# Altium project Esperto_Watch_V3.PrjPCB
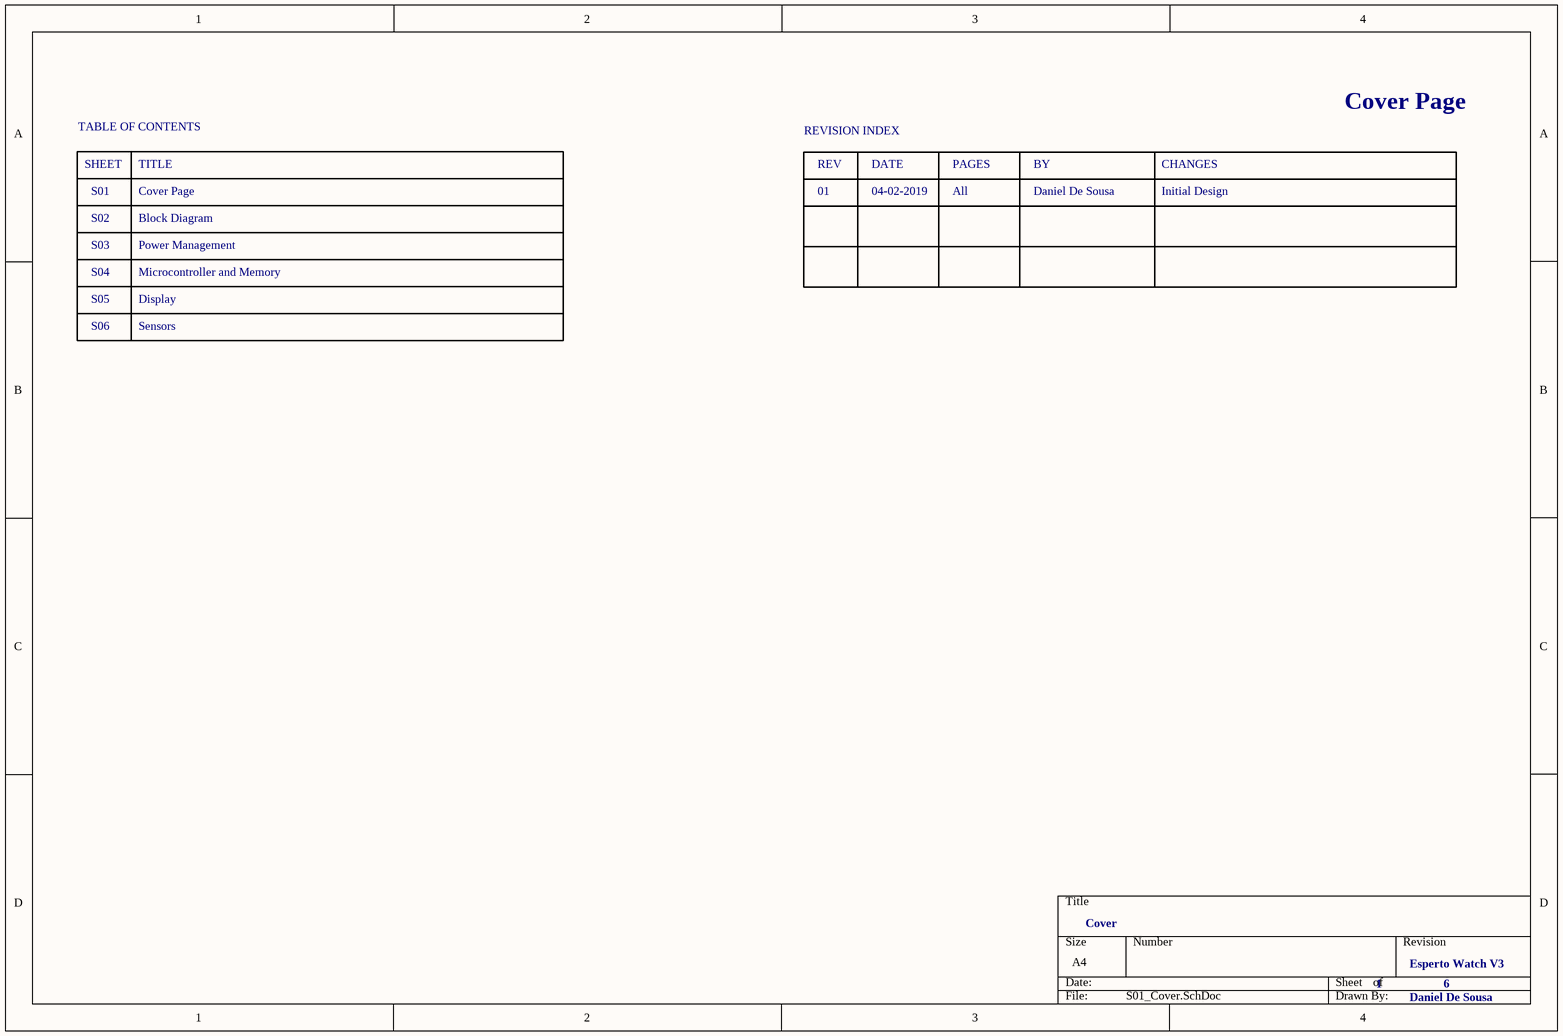
[diagram p0: S01_Cover.SchDoc]
client: Esperto Labs; PCBDate: 2019-01-02; PCBLayout: Daniel De Sousa; Project: Esperto Watch V3; ProjectTitle: Main Processor Board; SchRevision: 1
6 sheets, 69 parts. Net scope: flat (ports and power ports of the same name join across sheets).
Board file: Esperto_Watch_V3.PcbDoc
Sheets:
  S01_Cover.SchDoc
  S02_Block_Diagram.SchDoc
  S03_Power_Management.SchDoc
  S04_Microcontroller.SchDoc
  S05_Display.SchDoc
  S06_Sensors.SchDoc

## Sheet S01_Cover.SchDoc
size A4

### Notes on the sheet
- Cover Page
- TABLE OF CONTENTS
- SHEET
- TITLE
- REVISION INDEX
- REV
- DATE
- PAGES
- BY
- CHANGES
- S01
- S02
- S03
- Block Diagram
- Power Management
- 01
- 04-02-2019
- All
- Daniel De Sousa
- Initial Design
- S04
- S05
- Display
- Microcontroller and Memory
- S06
- Sensors
- Cover
- 1
- Esperto Watch V3
- 6

## Sheet S02_Block_Diagram.SchDoc
size A4
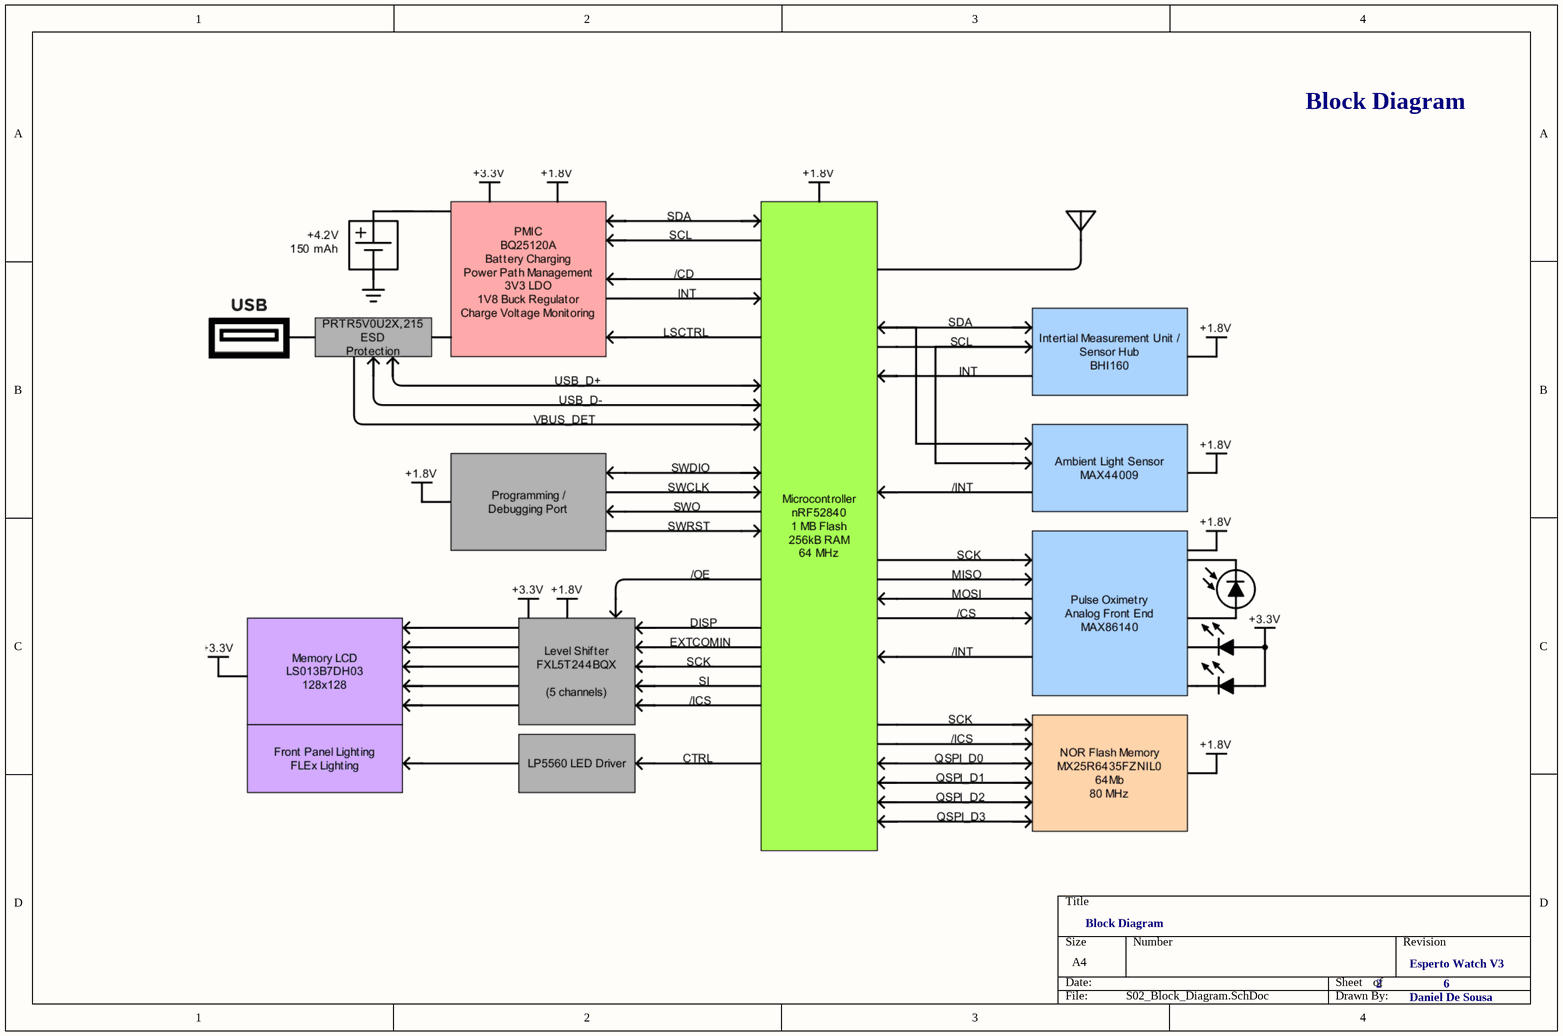
[diagram p1: S02_Block_Diagram.SchDoc]

### Notes on the sheet
- Block Diagram
- 2
- Esperto Watch V3
- 6
- Daniel De Sousa

## Sheet S03_Power_Management.SchDoc
size A4
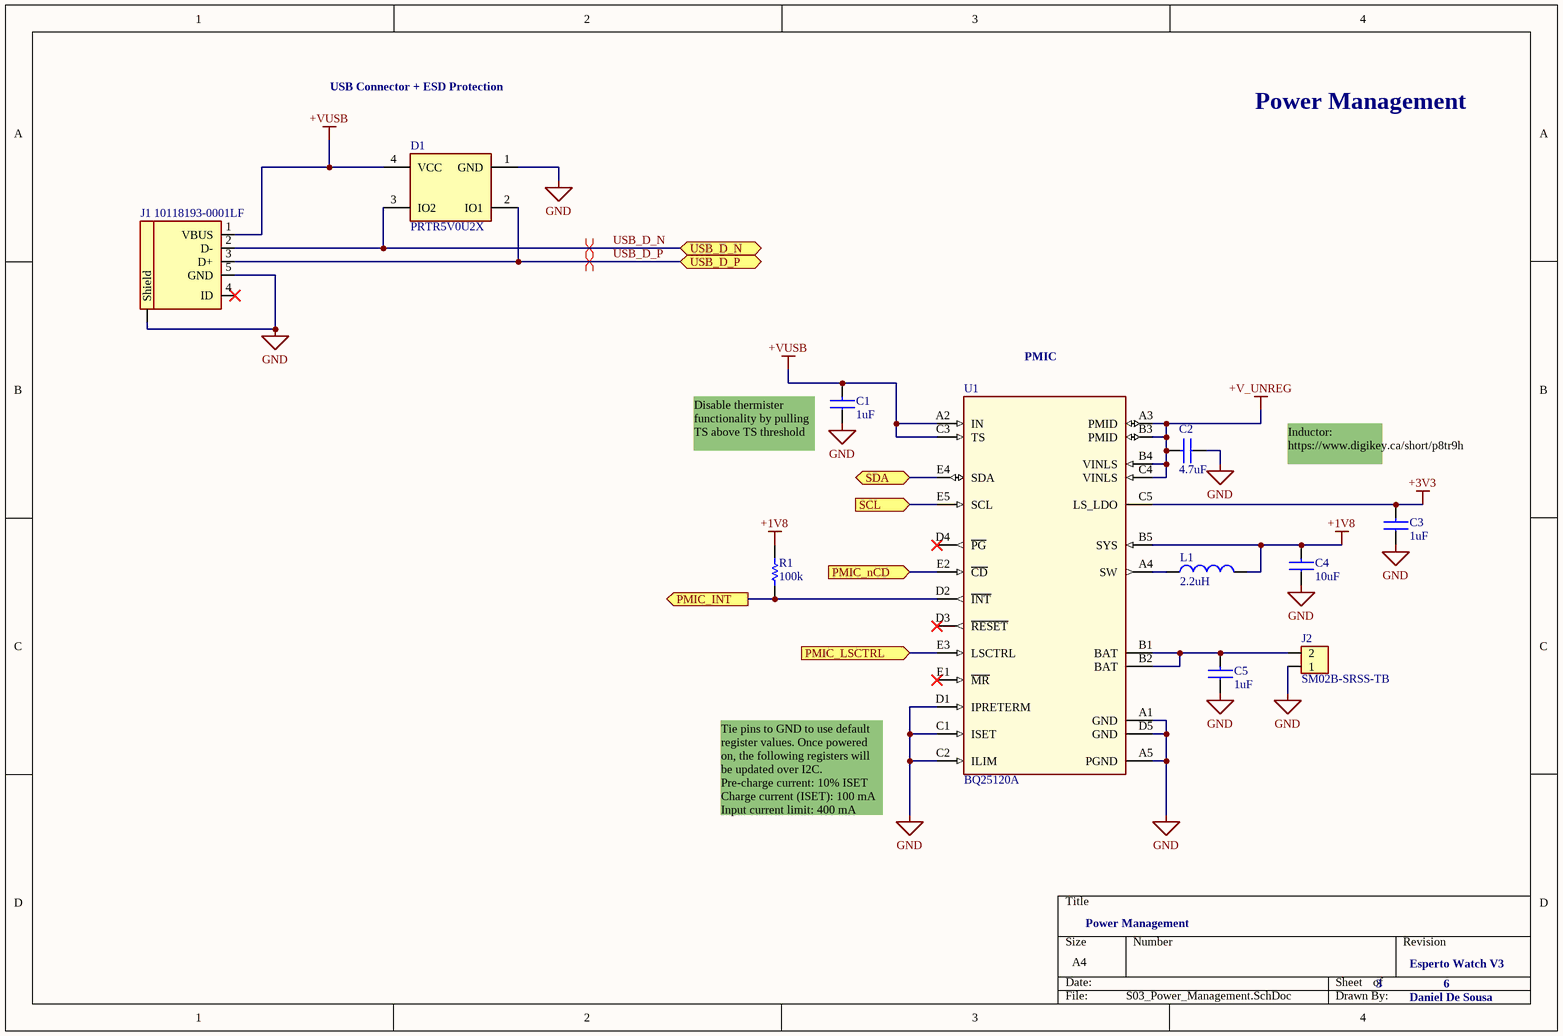
[diagram p2: S03_Power_Management.SchDoc]

### Parts
C1  1uF  [CC_1005_0402_N]
C2  4.7uF  [CC_1005_0402_N]
C3  1uF  [CC_1005_0402_N]
C4  10uF  [CC_1005_0402_N]
C5  1uF  [CC_1005_0402_N]
D1  PRTR5V0U2X  [PRTR5V0U2X]
J1  10118193-0001LF  [CONN_USB_MICRO_B]
J2  SM02B-SRSS-TB  [SM02B-SRSS-TB]
L1  2.2uH  [IND_1608_0603_N]
R1  100k  [RC_1005_0402_N]
U1  BQ25120A  [BQ25120A]

### Ports
PMIC_INT (out), PMIC_LSCTRL (in), PMIC_nCD (in), SCL (in), SDA (bidir), USB_D_N (bidir), USB_D_P (bidir)

### Nets
+1V8: C4.2 L1.2 R1.2 U1.B5(SYS)
+3V3: C3.2 U1.C5(LS_LDO)
+V_UNREG: C2.2 U1.A3(PMID) U1.B3(PMID) U1.B4(VINLS) U1.C4(VINLS)
+VUSB: C1.2 D1.4(VCC) J1.1(VBUS) U1.A2(IN) U1.C3(TS)
GND: C1.1 C2.1 C3.1 C4.1 C5.1 D1.1(GND) J1.5(GND) J1.6(Shield) J2.1 U1.A1(GND) U1.A5(PGND) U1.C1(ISET) U1.C2(ILIM) U1.D1(IPRETERM) U1.D5(GND)
PMIC_INT: R1.1 U1.D2(~{INT}) ; port PMIC_INT
PMIC_LSCTRL: U1.E3(LSCTRL) ; port PMIC_LSCTRL
PMIC_nCD: U1.E2(~{CD}) ; port PMIC_nCD
SCL: U1.E5(SCL) ; port SCL
SDA: U1.E4(SDA) ; port SDA
USB_D_N: D1.3(IO2) J1.2(D-) ; port USB_D_N
USB_D_P: D1.2(IO1) J1.3(D+) ; port USB_D_P
NetC5_2: C5.2 J2.2 U1.B1(BAT) U1.B2(BAT)
NetL1_1: L1.1 U1.A4(SW)

Not connected (* = marked no-connect by the designer): J1 4(ID)*; U1 D3(~{RESET})* D4(~{PG})* E1(~{MR})*

### Layout directives
differential pair: USB_D_N, USB_D_P

### Notes on the sheet
- USB Connector + ESD Protection
- Power Management
- PMIC
- (near C1) Disable thermister functionality by pulling TS above TS threshold
- Inductor: https://www.digikey.ca/short/p8tr9h
- Tie pins to GND to use default register values. Once powered on, the following registers will be updated over I2C.
  Pre-charge current: 10% ISET
  Charge current (ISET): 100 mA
  Input current limit: 400 mA
- 3
- Esperto Watch V3
- 6
- Daniel De Sousa

### Library data of the parts
C1-C5 = Capacitor
  C1 C3 C5: VALUE: 1uF
  C2: VALUE: 4.7uF
  C4: VALUE: 10uF
D1 = PRTR5V0U2X: Ultra low capacitance double rail-to-rail ESD protection diode; Manufacturer: NXP; 2nd source part number: 152-4157; Artikkelnr Noca: 10069015; Artikkelnr Simpro: N.A.; Part Number: PRTR5V0U2X; Manufacturer Part Number: PRTR5V0U2X; Datasheet: http://www.farnell.com/datasheets/109718.pdf; LatestRevisionDate: 2012-06-11; Publisher: Nordic Semiconductor; Published: 2012-06-11; Value: PRTR5V0U2X; Note: *; Supplier: Digi-Key; Supplier part number: 568-4140-1-ND; 2nd source Supplier: Farnell; Footprint Doc: SOT-143B
J1 = CONN_USB: MicroUSB-B-SMT; Part Number: USB-Micro-B-RA-SMD-PiP; Manufacturer: Allen Creations Corp.; Manufacturer Part Number: AJU55-BS2111-L; 2nd source part number: 609-4616-1-ND; Part number IPS: 00000007790; Artikkelnr Noca: 55029020; Artikkelnr Simpro: N.A.; Datasheet: \\hizz\pro\app9717\Datasheet\connectores\Allen Creations Corp\AJU-211.pdf; Footprint Doc: USB-Micro-B-RA-SMD-PiP; LatestRevisionDate: 2016-04-21; Pin Count: 5; Publisher: Nordic Semiconductor; Published: 2014-10-07; Value: MicroUSB-B; Note: *; Supplier: Cabcon; Supplier part number: AJU55-BS2111-L; 2nd source Supplier: Digi-Key
J2 = SM02B-SRSS-TB: 1.0mm pitch connector side entry SMD; Manufacturer: JST; Manufacturer Part Number: SM02B-SRSS-TB(LF)(SN); Part number IPS: 00000007791; Value: HDR-2, 1mm; Note: JST, Header; Artikkelnr Noca: 55010030; Artikkelnr Simpro: N.A.; Part Number: SM02B-SRSS-TB; Datasheet: http://www.jst-mfg.com/product/pdf/eng/eSH.pdf; Footprint Doc: SM02B-SRSS-TB; LatestRevisionDate: 2016-06-20; Pin Count: 2; Publisher: Nordic Semiconductor; Published: 2016-06-20; Supplier: Digi-Key; Supplier part number: 455-1802-1-ND; 2nd source Supplier: *; 2nd source part number: *
L1 = Inductor_0603: Inductor; VALUE: 2.2uH
R1 = Resistor: Value: 100k
U1 = BQ25120A: Battery Charge Management Solution; Manufacturer_Part_Number: BQ25120YFPR; Alternate_PartNumber: BQ25120YFPT; Vendor: Texas Instruments; Built_By: Texas_Instrument_Team; CompType: IC; Copyright: Copyright (C) 2018 Accelerated Designs. All rights reserved; RefDes: RefDes; Type: DEV; Value: Value; Application_BuildNumber: *; PartNumber: BQ25120YFPR; PackageReference: YFP0025BABD; MountType: SMT; RoHS: Y; Manufacturer: Texas Instruments

## Sheet S04_Microcontroller.SchDoc
size A4
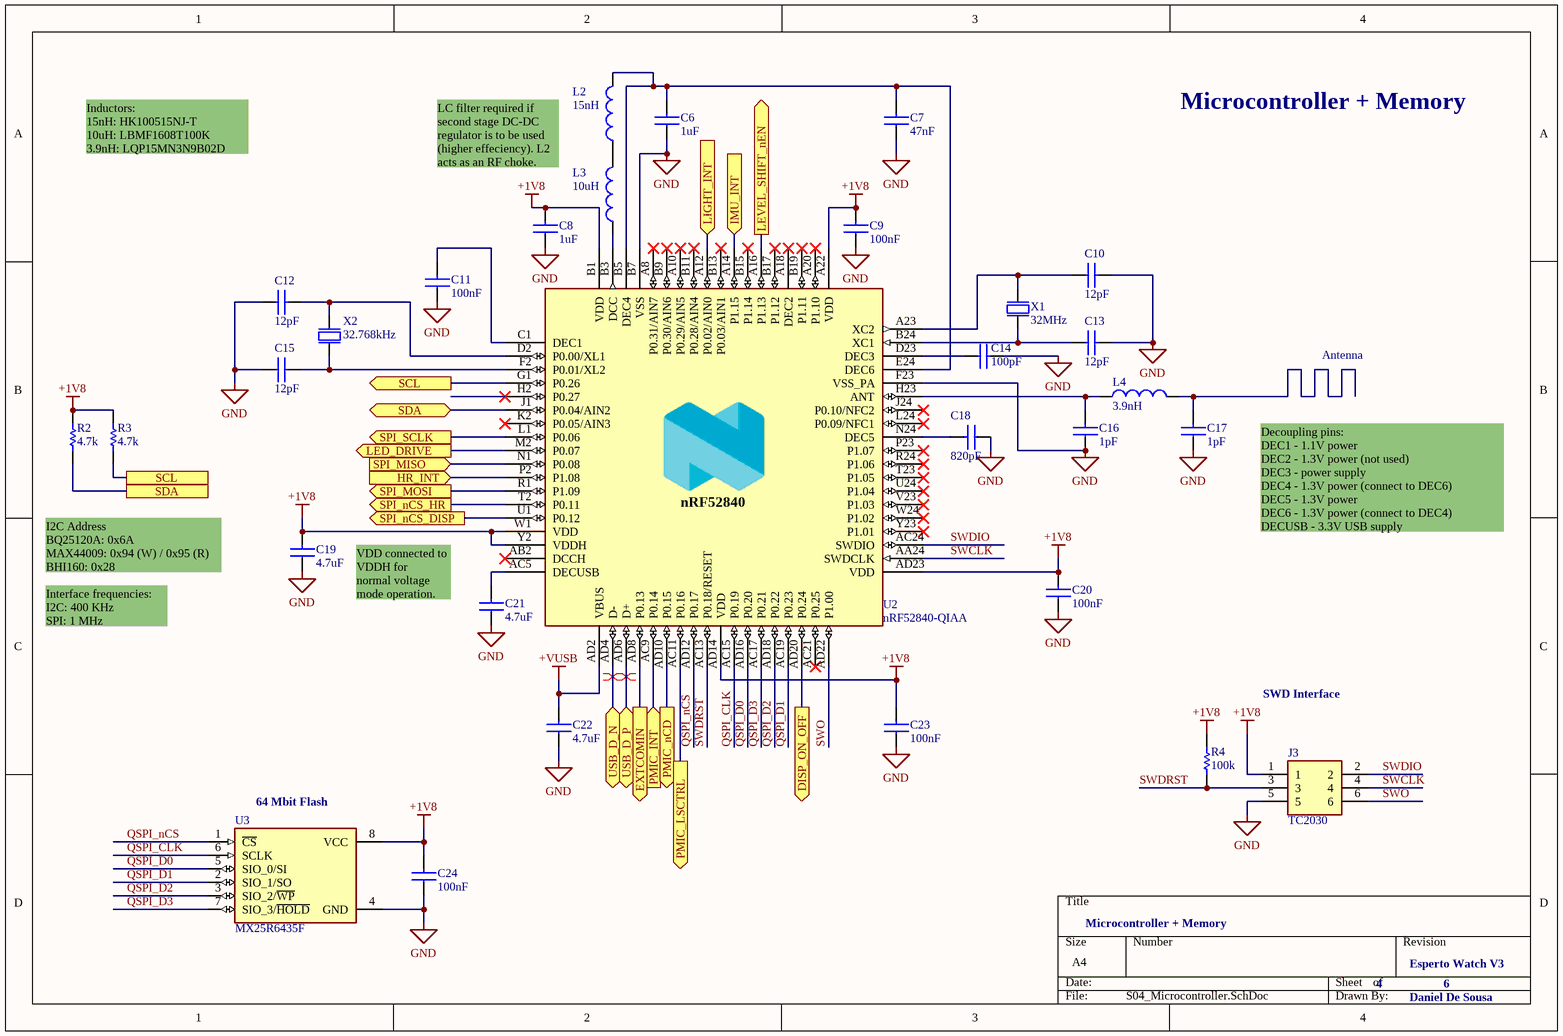
[diagram p3: S04_Microcontroller.SchDoc]

### Parts
C6  1uF  [CC_1005_0402_N]
C7  47nF  [CC_1005_0402_N]
C8  1uF  [CC_1005_0402_N]
C9  100nF  [CC_1005_0402_N]
C10  12pF  [CC_1005_0402_N]
C11  100nF  [CC_1005_0402_N]
C12  12pF  [CC_1005_0402_N]
C13  12pF  [CC_1005_0402_N]
C14  100pF  [CC_1005_0402_N]
C15  12pF  [CC_1005_0402_N]
C16  1pF  [CC_1005_0402_N]
C17  1pF  [CC_1005_0402_N]
C18  820pF  [CC_1005_0402_N]
C19  4.7uF  [CC_1005_0402_N]
C20  100nF  [CC_1005_0402_N]
C21  4.7uF  [CC_1005_0402_N]
C22  4.7uF  [CC_1005_0402_N]
C23  100nF  [CC_1005_0402_N]
C24  100nF  [CC_1005_0402_N]
J3  TC2030  [CONN_TC2030]  (no BOM)
L2  15nH  [RC_1005_0402_N]
L3  10uH  [IND_1608_0603_N]
L4  3.9nH  [RC_1005_0402_N]
R2  4.7k  [RC_1005_0402_N]
R3  4.7k  [RC_1005_0402_N]
R4  100k  [RC_1005_0402_N]
U2  nRF52840-QIAA  [nRF52840]
U3  MX25R6435F  [MX25R6435FZNIL0]
X1  32MHz  [XTAL_32M]
X2  32.768kHz  [XTAL_32K768]

### Ports
DISP_ON_OFF (out), EXTCOMIN (out), HR_INT (in), IMU_INT (in), LED_DRIVE (out), LEVEL_SHIFT_nEN (out), LIGHT_INT (in), PMIC_INT (in), PMIC_LSCTRL (out), PMIC_nCD (out), SCL, SCL (out), SDA, SDA (bidir), SPI_MISO (in), SPI_MOSI (out), SPI_nCS_DISP (out), SPI_nCS_HR (out), SPI_SCLK (out), USB_D_N (bidir), USB_D_P (bidir)

### Nets
+1V8: C8.2 C9.2 C19.2 C20.2 C23.2 C24.2 J3.1 R2.2 R3.2 R4.2 U2.A22(VDD) U2.AD14(VDD) U2.AD23(VDD) U2.B1(VDD) U2.W1(VDD) U2.Y2(VDDH) U3.8(VCC)
+VUSB: C22.2 U2.AD2(VBUS)
GND: C6.1 C7.1 C8.1 C9.1 C10.2 C11.1 C12.1 C13.2 C14.2 C15.1 C16.1 C17.1 C18.1 C19.1 C20.1 C21.1 C22.1 C23.1 C24.1 J3.5 U2.74(GND) U2.B7(VSS) U2.F23(VSS_PA) U3.4(GND) U3.9(GND) X1.2(GND) X1.4(GND)
DISP_ON_OFF: U2.AD20(P0.24) ; port DISP_ON_OFF
EXTCOMIN: U2.AD8(P0.13) ; port EXTCOMIN
HR_INT: U2.P2(P1.08) ; port HR_INT
IMU_INT: U2.A14(P1.15) ; port IMU_INT
LED_DRIVE: U2.M2(P0.07) ; port LED_DRIVE
LEVEL_SHIFT_nEN: U2.A16(P1.13) ; port LEVEL_SHIFT_nEN
LIGHT_INT: U2.A12(P0.02/AIN0) ; port LIGHT_INT
PMIC_INT: U2.AC9(P0.14) ; port PMIC_INT
PMIC_LSCTRL: U2.AC11(P0.16) ; port PMIC_LSCTRL
PMIC_nCD: U2.AD10(P0.15) ; port PMIC_nCD
QSPI_CLK: U2.AC15(P0.19) U3.6(SCLK)
QSPI_D0: U2.AD16(P0.20) U3.5(SIO_0/SI)
QSPI_D1: U2.AC19(P0.23) U3.2(SIO_1/SO)
QSPI_D2: U2.AD18(P0.22) U3.3(SIO_2/~{WP})
QSPI_D3: U2.AC17(P0.21) U3.7(SIO_3/~{HOLD})
QSPI_nCS: U2.AD12(P0.17) U3.1(~{CS})
SCL: R3.1 U2.G1(P0.26) ; port SCL
SDA: R2.1 U2.J1(P0.04/AIN2) ; port SDA
SPI_MISO: U2.N1(P0.08) ; port SPI_MISO
SPI_MOSI: U2.R1(P1.09) ; port SPI_MOSI
SPI_nCS_DISP: U2.U1(P0.12) ; port SPI_nCS_DISP
SPI_nCS_HR: U2.T2(P0.11) ; port SPI_nCS_HR
SPI_SCLK: U2.L1(P0.06) ; port SPI_SCLK
SWCLK: J3.4 U2.AA24(SWDCLK)
SWDIO: J3.2 U2.AC24(SWDIO)
SWDRST: J3.3 R4.1 U2.AC13(P0.18/RESET)
SWO: J3.6 U2.AD22(P1.00)
USB_D_N: U2.AD4(D-) ; port USB_D_N
USB_D_P: U2.AD6(D+) ; port USB_D_P
NetC6_2: C6.2 C7.2 L2.2 U2.B5(DEC4) U2.E24(DEC6)
NetC10_1: C10.1 U2.A23(XC2) X1.3(out)
NetC11_2: C11.2 U2.C1(DEC1)
NetC12_2: C12.2 U2.D2(P0.00/XL1) X2.2(out)
NetC13_1: C13.1 U2.B24(XC1) X1.1(inp)
NetC14_1: C14.1 U2.D23(DEC3)
NetC15_2: C15.2 U2.F2(P0.01/XL2) X2.1(inp)
NetC16_2: C16.2 L4.1 U2.H23(ANT)
NetC17_2: C17.2 L4.2
NetC18_2: C18.2 U2.N24(DEC5)
NetC21_2: C21.2 U2.AC5(DECUSB)
NetL2_1: L2.1 L3.2
NetL3_1: L3.1 U2.B3(DCC)

Not connected (* = marked no-connect by the designer): U2 A8(P0.31/AIN7)* A10(P0.29/AIN5)* A18(DEC2)* A20(P1.10)* AB2(DCCH)* AC21(P0.25)* B9(P0.30/AIN6)* B11(P0.28/AIN4)* B13(P0.03/AIN1)* B15(P1.14)* B17(P1.12)* B19(P1.11)* H2(P0.27)* J24(P0.10/NFC2)* K2(P0.05/AIN3)* L24(P0.09/NFC1)* P23(P1.07)* R24(P1.06)* T23(P1.05)* U24(P1.04)* V23(P1.03)* W24(P1.02)* Y23(P1.01)*

### Layout directives
differential pair: USB_D_N, USB_D_P

### Notes on the sheet
- Microcontroller + Memory
- Inductors:
  15nH: HK100515NJ-T
  10uH: LBMF1608T100K
  3.9nH: LQP15MN3N9B02D
- LC filter required if second stage DC-DC regulator is to be used (higher effeciency). L2 acts as an RF choke.
- Antenna
- I2C Address
  BQ25120A: 0x6A
  MAX44009: 0x94 (W) / 0x95 (R)
  BHI160: 0x28
- Decoupling pins:
  DEC1 - 1.1V power
  DEC2 - 1.3V power (not used)
  DEC3 - power supply
  DEC4 - 1.3V power (connect to DEC6)
  DEC5 - 1.3V power
  DEC6 - 1.3V power (connect to DEC4)
  DECUSB - 3.3V USB supply
- Interface frequencies:
  I2C: 400 KHz
  SPI: 1 MHz
- VDD connected to VDDH for
  normal voltage mode operation.
  Disables first regulator stage
- SWD Interface
- (near U3) 64 Mbit Flash
- 4
- Esperto Watch V3
- 6
- Daniel De Sousa

### Library data of the parts
C6-C24 = Capacitor
  C6 C8: VALUE: 1uF
  C7: VALUE: 47nF
  C9 C11 C20 C23 C24: VALUE: 100nF
  C10 C12 C13 C15: VALUE: 12pF
  C14: VALUE: 100pF
  C16 C17: VALUE: 1pF
  C18: VALUE: 820pF
  C19 C21 C22: VALUE: 4.7uF
L2 L4 = Inductor_0402: Inductor
  L2: VALUE: 15nH
  L4: VALUE: 3.9nH
L3 = Inductor_0603: Inductor; VALUE: 10uH
R2-R4 = Resistor
  R2 R3: Value: 4.7k
  R4: Value: 100k
U2 = nRF52840: Multi-protocol Bluetooth Low Energy, IEEE 802.15.4, ANT and 2.4GHz proprietary system-on-chip; Part Number: nRF52840-QIAAC0; Manufacturer: Nordic Semiconductor; Artikkelnr Noca: N.A.; LatestRevisionDate: 2017-12-06; Pin Count: 73; Publisher: Nordic Semiconductor; Published: 2017-08-21; Value: nRF52840-QIAA; Note: *; Footprint Doc: AQFN-73; Manufacturer Part Number: nRF52840-QIAAC0; Supplier: Nordic Semiconductor; Supplier part number: nRF52840-QIAAC0; 2nd source Supplier: *; 2nd source part number: *; Artikkelnr Simpro: N.A.; Part number IPS: N.A.; ComponentLink1Description: Datasheet; ComponentLink1URL: *; ComponentLink2Description: Supplier link; ComponentLink2URL: *; HelpURL: *
U3 = MX25R6435FZNIL0: Ultra low power, 64M-bit, serial multi I/O flash memory; Manufacturer: Macronix; Artikkelnr Noca: 15020015; Artikkelnr Simpro: N.A.; Part Number: MX25R6435FZNIL0; Manufacturer Part Number: MX25R6435FZNIL0; Datasheet: http://www.macronix.com/Lists/Datasheet/Attachments/3881/MX25R6435F,%20Wide%20Range,%2064Mb,%20v1.3.pdf; Footprint Doc: WSON-8; LatestRevisionDate: 2016-06-29; Pin Count: 8; Publisher: Nordic Semiconductor; Published: 2016-06-29; Value: MX25R6435F; Note: *; Supplier: Future; Supplier part number: MX25R6435FZNIL0; 2nd source Supplier: Arrow; 2nd source part number: MX25R6435FZNIL0
X1 = XTAL_32M: XTAL SMD 2016, 32MHz, Cl=8pF, Tol: ±10ppm, Stab: ±10ppm; Part Number: XTAL_SMD2016_32MHz_8pF_Murata; Manufacturer: Murata; Manufacturer Part Number: XRCGB32M000F1H01R0; Part number IPS: 80000001424; Note: XTAL SMD 32.000MHz; Artikkelnr Noca: N.A.; LatestRevisionDate: 2017-11-09; Pin Count: 4; Publisher: Nordic Semiconductor; Published: 2016-10-26; Value: 32MHz; Supplier: *; Supplier part number: *; 2nd source Supplier: *; 2nd source part number: *; Footprint Doc: XTAL_2016; Artikkelnr Simpro: N.A.; ComponentLink1Description: Datasheet; ComponentLink1URL: *; ComponentLink2Description: Supplier link; ComponentLink2URL: *; HelpURL: http://www.murata.com/en-global/products/productdetail.aspx?cate=cgsubCrystalUnits&partno=XRCGB32M000F1H01R0
X2 = XTAL_32K768: XTAL SMD 2012, 32.768kHz, 9pF, ±20ppm; Part Number: XTAL_SMD2012_32.768kHz_9pF_Seiko; Manufacturer: Seiko; Manufacturer Part Number: SC20S-9.0PF20PPM; Part number IPS: 80000001425; Note: XTAL SMD 32.768kHz; Artikkelnr Noca: N.A.; LatestRevisionDate: 2017-11-09; Pin Count: 2; Publisher: Nordic Semiconductor; Published: 2015-10-15; Value: 32.768kHz; Supplier: *; Supplier part number: *; 2nd source Supplier: *; 2nd source part number: *; Footprint Doc: XTAL_2012; Artikkelnr Simpro: N.A.; ComponentLink1Description: Datasheet; ComponentLink1URL: *; ComponentLink2Description: Supplier link; ComponentLink2URL: *; HelpURL: http://www.sii.co.jp/en/quartz/files/2013/03/file_PRODUCT_MASTER_50811_GRAPHIC03.pdf

## Sheet S05_Display.SchDoc
size A4
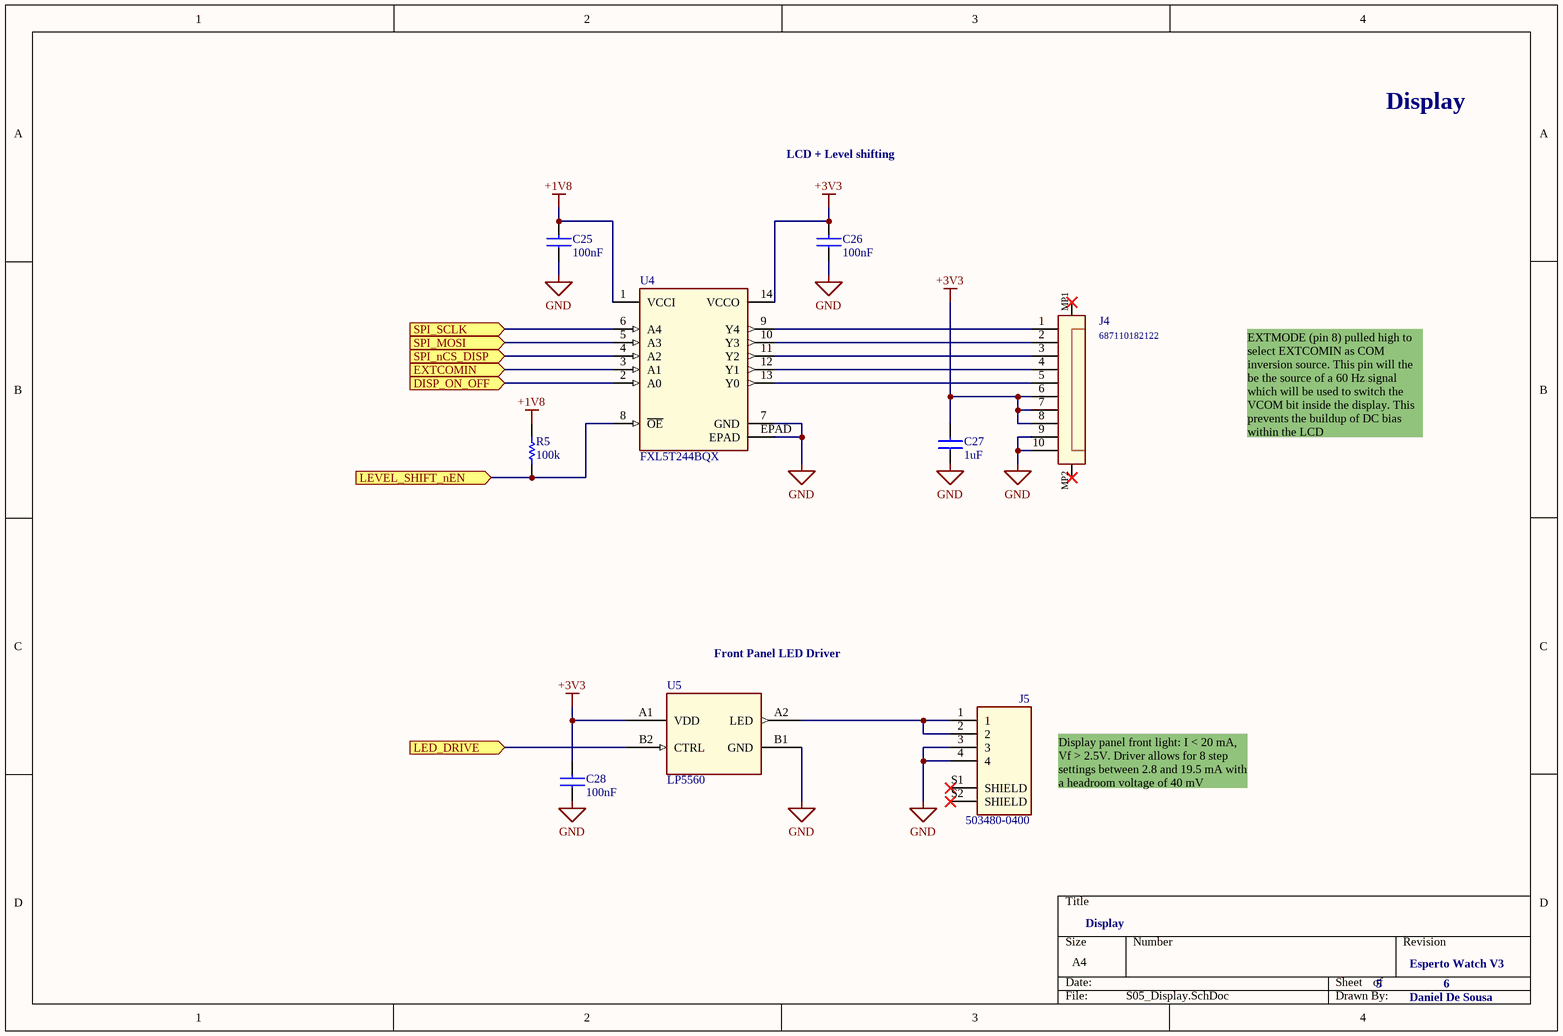
[diagram p4: S05_Display.SchDoc]

### Parts
C25  100nF  [CC_1005_0402_N]
C26  100nF  [CC_1005_0402_N]
C27  1uF  [CC_1005_0402_N]
C28  100nF  [CC_1005_0402_N]
J4  687110182122  [687110182122]
J5  503480-0400  [503480-0400]
R5  100k  [RC_1005_0402_N]
U4  FXL5T244BQX  [FXL5T244BQX]
U5  LP5560  [LP5560]

### Ports
DISP_ON_OFF (in), EXTCOMIN (in), LED_DRIVE (in), LEVEL_SHIFT_nEN (in), SPI_MOSI (in), SPI_nCS_DISP (in), SPI_SCLK (in)

### Nets
+1V8: C25.2 R5.2 U4.1(VCCI)
+3V3: C26.2 C27.2 C28.2 J4.6 J4.7 J4.8 U4.14(VCCO) U5.A1(VDD)
GND: C25.1 C26.1 C27.1 C28.1 J4.9 J4.10 J5.3 J5.4 U4.7(GND) U4.EPAD U5.B1(GND)
DISP_ON_OFF: U4.2(A0) ; port DISP_ON_OFF
EXTCOMIN: U4.3(A1) ; port EXTCOMIN
LED_DRIVE: U5.B2(CTRL) ; port LED_DRIVE
LEVEL_SHIFT_nEN: R5.1 U4.8(~{OE}) ; port LEVEL_SHIFT_nEN
SPI_MOSI: U4.5(A3) ; port SPI_MOSI
SPI_nCS_DISP: U4.4(A2) ; port SPI_nCS_DISP
SPI_SCLK: U4.6(A4) ; port SPI_SCLK
NetJ4_1: J4.1 U4.9(Y4)
NetJ4_2: J4.2 U4.10(Y3)
NetJ4_3: J4.3 U4.11(Y2)
NetJ4_4: J4.4 U4.12(Y1)
NetJ4_5: J4.5 U4.13(Y0)
NetJ5_1: J5.1 J5.2 U5.A2(LED)

Not connected (* = marked no-connect by the designer): J4 MP1* MP2*; J5 S1(SHIELD)* S2(SHIELD)*

### Notes on the sheet
- Display
- LCD + Level shifting
- EXTMODE (pin 8) pulled high to select EXTCOMIN as COM inversion source. This pin will the be the source of a 60 Hz signal which will be used to switch the VCOM bit inside the display. This prevents the buildup of DC bias within the LCD
- Front Panel LED Driver
- Display panel front light: I < 20 mA, Vf > 2.5V. Driver allows for 8 step settings between 2.8 and 19.5 mA with a headroom voltage of 40 mV
- 5
- Esperto Watch V3
- 6
- Daniel De Sousa

### Library data of the parts
C25-C28 = Capacitor
  C25 C26 C28: VALUE: 100nF
  C27: VALUE: 1uF
J4 = 687110182122: SMT ZIF Connectors WR-FPC, Horizontal, Back Locking Dual Contact, pitch 0.5 mm, 10 pins; Rated Current: 0.5 A; Contact Resistance: 30 mOhm; Withstanding Voltage: 250 VAC; Working Voltage: 50 VAC; Pin Number: 10; Pitch: 0.5 mm; ComponentLink1Description: Manufacturer; ComponentLink1URL: http://www.we-online.de; ComponentLink2Description: Datasheet; ComponentLink2URL: https://katalog.we-online.de/em/datasheet/687110182122.pdf; Part Number: 687110182122; Published Date: August 2018; Publisher: Wurth Elektronik; Operating Temperature: -55 to 85 degC; Packaging: Tape and Reel; Mounting Technology: SMT; Orientation: Horizontal; Contact Design: Back Locking Dual Contact
J5 = 503480-0400: 0.50mm Pitch Easy-On; MP: 5034800400; MF: Molex; Package: None; SnapEDA_Link: https://www.snapeda.com/parts/5034800400/Molex/view-part/?ref=snap; Digi-Key_Part_Number: WM1386CT-ND; Digi-Key_Purchase_URL: https://www.digikey.ca/product-detail/en/molex/5034800400/WM1386CT-ND/2356640?utm_source=snapeda&utm_medium=aggregator&utm_campaign=symbol; Value: *
R5 = Resistor: Value: 100k
U4 = FXL5T244BQX: Voltage Level Translator Unidirectional 1 Circuit 5 Channel; MF: ON Semiconductor; MP: FXLA108BQX; Package: DQFN-20 ON Semiconductor; Digi-Key_Purchase_URL: https://www.digikey.ca/product-detail/en/on-semiconductor/FXLA108BQX/FXLA108BQXCT-ND/2051660?utm_source=snapeda&utm_medium=aggregator&utm_campaign=symbol; Digi-Key_Part_Number: FXLA108BQXCT-ND; SnapEDA_Link: https://www.snapeda.com/parts/FXLA108BQX/ON%20Semiconductor/view-part/?ref=snap; Value: *
U5 = LP5560: Programmable Single-LED Driver; Manufacturer_Part_Number: LP5522TM/NOPB; Vendor: Texas Instruments; Built_By: EMA_UL_Team; Copyright: Copyright (C) 2018 Accelerated Designs. All rights reserved; RefDes: RefDes; Type: DEV; Value: Value

## Sheet S06_Sensors.SchDoc
size A4
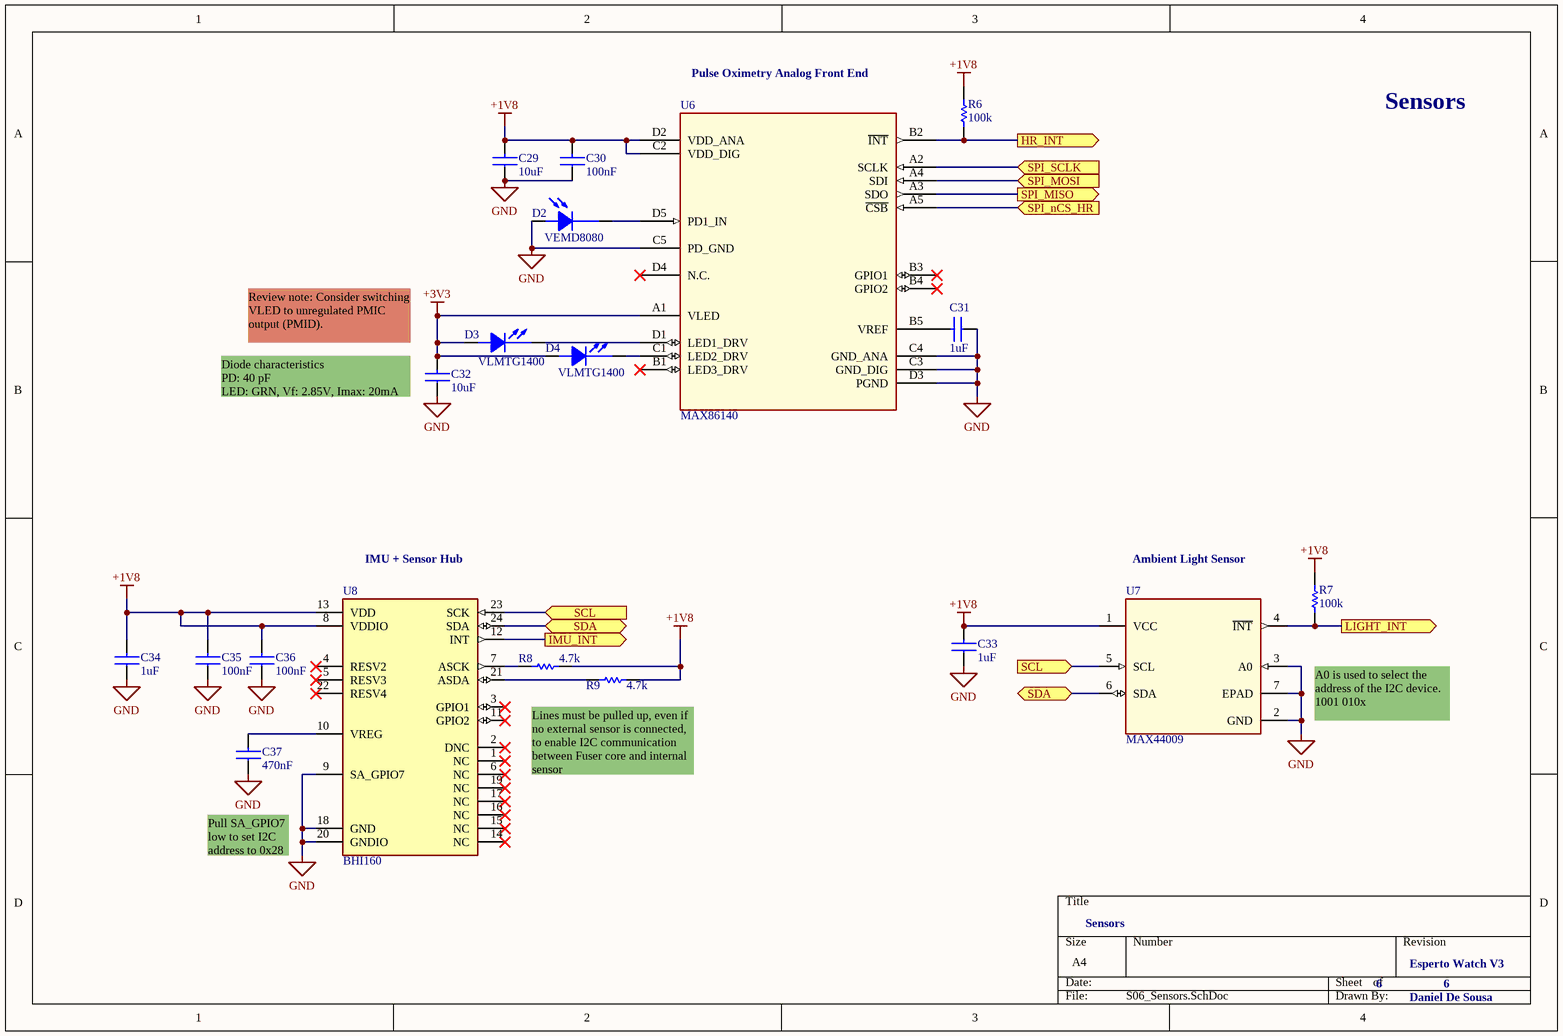
[diagram p5: S06_Sensors.SchDoc]

### Parts
C29  10uF  [CC_1005_0402_N]
C30  100nF  [CC_1005_0402_N]
C31  1uF  [CC_1005_0402_N]
C32  10uF  [CC_1005_0402_N]
C33  1uF  [CC_1005_0402_N]
C34  1uF  [CC_1005_0402_N]
C35  100nF  [CC_1005_0402_N]
C36  100nF  [CC_1005_0402_N]
C37  470nF  [CC_1005_0402_N]
D2  VEMD8080  [VEMD8080]
D3  VLMTG1400  [LED_GREEN_0603]
D4  VLMTG1400  [LED_GREEN_0603]
R6  100k  [RC_1005_0402_N]
R7  100k  [RC_1005_0402_N]
R8  4.7k  [RC_1005_0402_N]
R9  4.7k  [RC_1005_0402_N]
U6  MAX86140  [MAX86140]
U7  MAX44009  [MAX44009]
U8  BHI160  [BHI160]

### Ports
HR_INT (out), IMU_INT (out), LIGHT_INT (out), SCL (in), SDA (bidir), SPI_MISO (out), SPI_MOSI (in), SPI_nCS_HR (in), SPI_SCLK (in)

### Nets
+1V8: C29.2 C30.2 C33.2 C34.2 C35.2 C36.2 R6.2 R7.2 R8.1 R9.1 U6.C2(VDD_DIG) U6.D2(VDD_ANA) U7.1(VCC) U8.8(VDDIO) U8.13(VDD)
+3V3: C32.2 D3.A(Anode) D4.A(Anode) U6.A1(VLED)
GND: C29.1 C30.1 C31.1 C32.1 C33.1 C34.1 C35.1 C36.1 C37.1 D2.A(Anode) U6.C3(GND_DIG) U6.C4(GND_ANA) U6.C5(PD_GND) U6.D3(PGND) U7.2(GND) U7.3(A0) U7.7(EPAD) U8.9(SA_GPIO7) U8.18(GND) U8.20(GNDIO)
HR_INT: R6.1 U6.B2(~{INT}) ; port HR_INT
IMU_INT: U8.12(INT) ; port IMU_INT
LIGHT_INT: R7.1 U7.4(~{INT}) ; port LIGHT_INT
SCL: U7.5(SCL) U8.23(SCK) ; port SCL
SDA: U7.6(SDA) U8.24(SDA) ; port SDA
SPI_MISO: U6.A3(SDO) ; port SPI_MISO
SPI_MOSI: U6.A4(SDI) ; port SPI_MOSI
SPI_nCS_HR: U6.A5(~{CSB}) ; port SPI_nCS_HR
SPI_SCLK: U6.A2(SCLK) ; port SPI_SCLK
NetC31_2: C31.2 U6.B5(VREF)
NetC37_2: C37.2 U8.10(VREG)
NetD2_K: D2.K(Cathode) U6.D5(PD1_IN)
NetD3_K: D3.K(Cathode) U6.D1(LED1_DRV)
NetD4_K: D4.K(Cathode) U6.C1(LED2_DRV)
NetR8_2: R8.2 U8.7(ASCK)
NetR9_2: R9.2 U8.21(ASDA)

Not connected (* = marked no-connect by the designer): U6 B1(LED3_DRV)* B3(GPIO1)* B4(GPIO2)* D4(N.C.)*; U8 1(NC)* 2(DNC)* 3(GPIO1)* 4(RESV2)* 5(RESV3)* 6(NC)* 11(GPIO2)* 14(NC)* 15(NC)* 16(NC)* 17(NC)* 19(NC)* 22(RESV4)*

### Notes on the sheet
- Pulse Oximetry Analog Front End
- Sensors
- (near C32) Review note: Consider switching VLED to unregulated PMIC output (PMID).
- (near C32) Diode characteristics
  PD: 40 pF
  LED: GRN, Vf: 2.85V, Imax: 20mA
- (near U8) IMU + Sensor Hub
- Ambient Light Sensor
- A0 is used to select the address of the I2C device. 1001 010x
- Lines must be pulled up, even if no external sensor is connected, to enable I2C communication between Fuser core and internal sensor
- Pull SA_GPIO7 low to set I2C address to 0x28
- 6
- Esperto Watch V3
- Daniel De Sousa

### Library data of the parts
C29-C37 = Capacitor
  C29 C32: VALUE: 10uF
  C30 C35 C36: VALUE: 100nF
  C31 C33 C34: VALUE: 1uF
  C37: VALUE: 470nF
D2 = Photodiode
D3 D4 = LED: Single LED
R6-R9 = Resistor
  R6 R7: Value: 100k
  R8 R9: Value: 4.7k
U6 = MAX86140: Optical Pulse Oximeter and / Heart-Rate Sensor; Manufacturer_Part_Number: MAX86140ENP+; Built_By: EMA_UL_Team; Vendor: Maxim Integrated Products; Copyright: Copyright (C) 2018 Accelerated Designs. All rights reserved; RefDes: RefDes; Type: DEV; Value: Value
U7 = MAX44009: Ambient Light Sensor; Manufacturer_Part_Number: MAX44009EDT+T; Built_By: EMA_UL_Team; Vendor: Maxim Integrated Products; Copyright: Copyright (C) 2018 Accelerated Designs. All rights reserved; RefDes: RefDes; Type: DEV; Value: Value
U8 = BHI160: Ultra low-power sensor hub incl. integrated IMU; Part_Type: IC; Provided By: BOSCH; Package: *; ComponentLink1Description: *; ComponentLink1URL: *; Manufacturer_Part_Number: BHI160

## Nets that join several sheets
+1V8: S03_Power_Management (C4.2 L1.2 R1.2 U1.B5), S04_Microcontroller (17 pins), S05_Display (C25.2 R5.2 U4.1), S06_Sensors (15 pins)
+3V3: S03_Power_Management (C3.2 U1.C5), S05_Display (8 pins), S06_Sensors (C32.2 D3.A D4.A U6.A1)
+VUSB: S03_Power_Management (5 pins), S04_Microcontroller (C22.2 U2.AD2)
GND: S03_Power_Management (15 pins), S04_Microcontroller (27 pins), S05_Display (11 pins), S06_Sensors (20 pins)
DISP_ON_OFF: S04_Microcontroller (U2.AD20), S05_Display (U4.2)
EXTCOMIN: S04_Microcontroller (U2.AD8), S05_Display (U4.3)
HR_INT: S04_Microcontroller (U2.P2), S06_Sensors (R6.1 U6.B2)
IMU_INT: S04_Microcontroller (U2.A14), S06_Sensors (U8.12)
LED_DRIVE: S04_Microcontroller (U2.M2), S05_Display (U5.B2)
LEVEL_SHIFT_nEN: S04_Microcontroller (U2.A16), S05_Display (R5.1 U4.8)
LIGHT_INT: S04_Microcontroller (U2.A12), S06_Sensors (R7.1 U7.4)
PMIC_INT: S03_Power_Management (R1.1 U1.D2), S04_Microcontroller (U2.AC9)
PMIC_LSCTRL: S03_Power_Management (U1.E3), S04_Microcontroller (U2.AC11)
PMIC_nCD: S03_Power_Management (U1.E2), S04_Microcontroller (U2.AD10)
SCL: S03_Power_Management (U1.E5), S04_Microcontroller (R3.1 U2.G1), S06_Sensors (U7.5 U8.23)
SDA: S03_Power_Management (U1.E4), S04_Microcontroller (R2.1 U2.J1), S06_Sensors (U7.6 U8.24)
SPI_MISO: S04_Microcontroller (U2.N1), S06_Sensors (U6.A3)
SPI_MOSI: S04_Microcontroller (U2.R1), S05_Display (U4.5), S06_Sensors (U6.A4)
SPI_nCS_DISP: S04_Microcontroller (U2.U1), S05_Display (U4.4)
SPI_nCS_HR: S04_Microcontroller (U2.T2), S06_Sensors (U6.A5)
SPI_SCLK: S04_Microcontroller (U2.L1), S05_Display (U4.6), S06_Sensors (U6.A2)
USB_D_N: S03_Power_Management (D1.3 J1.2), S04_Microcontroller (U2.AD4)
USB_D_P: S03_Power_Management (D1.2 J1.3), S04_Microcontroller (U2.AD6)

## Assembly variants
Production: not fitted C3 C4 C8 C25 C188 C189 C190 C191 D1 D2 D4 F2 F3 F5 FB2 FB3 R13 R41 R42 R64 R65 R69 R73 R82 R93 R96 R106 R108 R109 R110 R142 R145 R148 R149 R153 R156 R166 R172 R175 R176 R180